# Altium schematic sheet cap_sense.SchDoc
size A
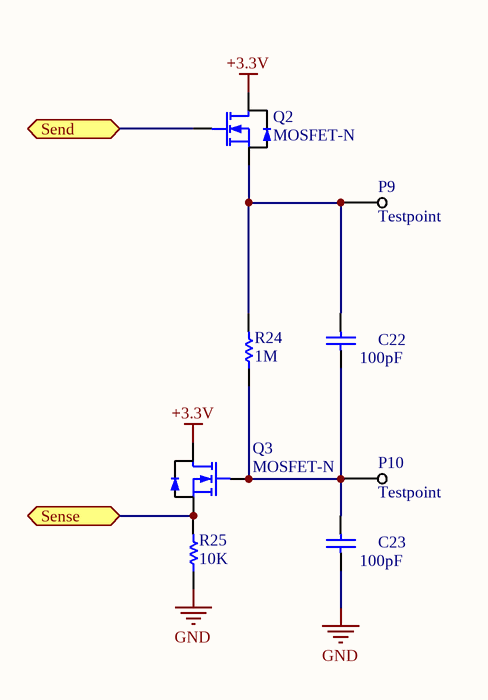
[diagram p0: cap_sense.SchDoc]

## Parts
C22  value 100pF  [1608[0603]]  (hidden comment: Cap)
C23  value 100pF  [1608[0603]]  (hidden comment: Cap)
P9  Testpoint  [Testpoint]
P10  Testpoint  [Testpoint]
Q2  MOSFET-N  [SOT23]
Q3  MOSFET-N  [SOT23]
R24  value 1M  [J1-0603]  (hidden comment: Res)
R25  value 10K  [J1-0603]  (hidden comment: Res)

## Ports
Send, Sense

## Nets
+3.3V: Q2.3(D) Q3.3(D)
GND: C23.2 R25.1
Send: Q2.1(G) ; port Send
Sense: Q3.2(S) R25.2 ; port Sense
NetC22_1: C22.1 P9.1 Q2.2(S) R24.2
NetC22_2: C22.2 C23.1 P10.1 Q3.1(G) R24.1

## Library data of the parts
C22 C23 = Cap: Capacitor; Published: 8-Jun-2000; LatestRevisionDate: 17-Jul-2002; LatestRevisionNote: Re-released for DXP Platform.; PackageReference: RAD-0.3; Publisher: Altium Limited; PackageDescription: Radial Cap, Thru-Hole; 2 Leads; 0.3 in Pin Spacing
Q2 Q3 = MOSFET-N: N-Channel MOSFET; Published: 8-Jun-2000; LatestRevisionDate: 17-Jul-2002; LatestRevisionNote: Re-released for DXP Platform.; PackageVersion: 1995/1996; PackageReference: E3; Publisher: Altium Limited; PackageDescription: TO, Flat Index; 3 In-Line, Axial Leads; Body Dia. 4.6mm; Lead Dia. 0.5 mm (max)
R24 R25 = Res: Resistor 0805; Published: 8-Jun-2000; LatestRevisionDate: 17-Jul-2002; LatestRevisionNote: Re-released for DXP Platform.; PackageReference: AXIAL-0.3; Publisher: Altium Limited; PackageDescription: Axial Device, Thru-Hole; 2 Leads; 0.3 in Pin Spacing